# EAGLE design QFN triple breakout (EAGLE 6.1)
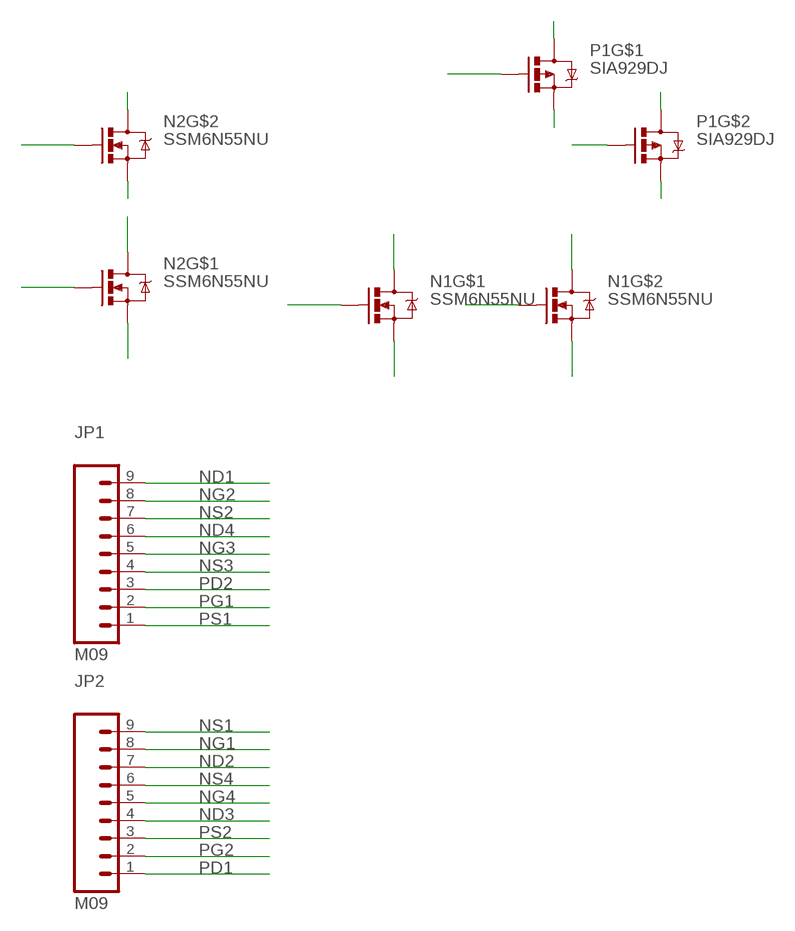
[diagram p0: schematic, sheet 1]

## Parts
JP1  M09  [1X09]
JP2  M09  [1X09]
N1  SSM6N55NU  [UDFN6]
N2  SSM6N55NU  [UDFN6]
P1  SIA929DJ  [SC70-6L]

## Nets
ND1: JP1.9 N2.D2$2(D) N2.D2(D)
ND2: JP2.7 N2.D1$1(D) N2.D1(D)
ND3: JP2.4 N1.D1$1(D) N1.D1(D)
ND4: JP1.6 N1.D2$2(D) N1.D2(D)
NG1: JP2.8 N2.G2(G)
NG2: JP1.8 N2.G1(G)
NG3: JP1.5 N1.G1(G)
NG4: JP2.5 N1.G2(G)
NS1: JP2.9 N2.S2(S)
NS2: JP1.7 N2.S1(S)
NS3: JP1.4 N1.S1(S)
NS4: JP2.6 N1.S2(S)
PD1: JP2.1 P1.D1$2(D) P1.D1(D)
PD2: JP1.3 P1.D2$2(D) P1.D2(D)
PG1: JP1.2 P1.G1(G)
PG2: JP2.2 P1.G2(G)
PS1: JP1.1 P1.S1(S)
PS2: JP2.3 P1.S2(S)

## Library data of the parts
JP1 JP2 = SparkFun-Connectors:M09: Header 9 Standard 9-pin 0.1" header. Use with straight break away headers (SKU : PRT-00116), right angle break away headers (PRT-00553), swiss pins (PRT-00743), machine pins (PRT-00117), and female headers (PRT-00115).
N1 N2 = Railstars:SSM6N55NU
P1 = Railstars:SIA929DJ

## Board
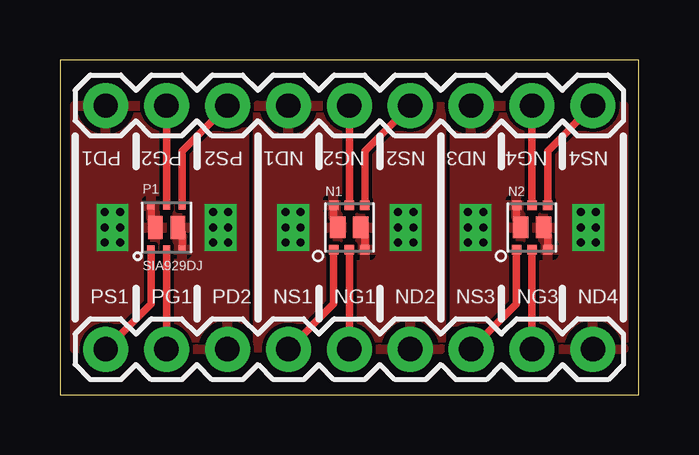
[diagram p1: board, top side]
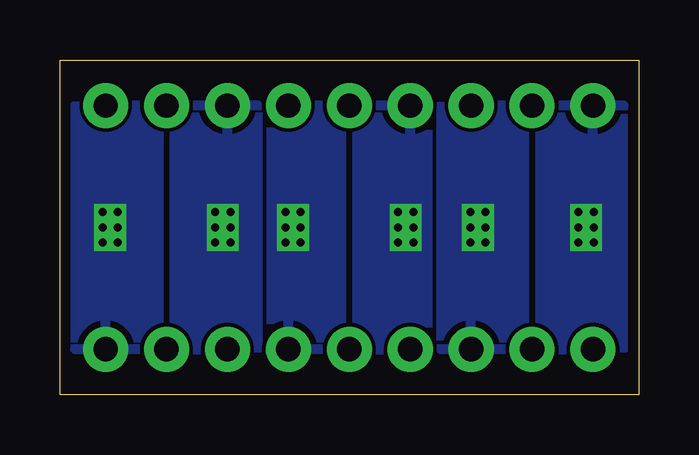
[diagram p2: board, bottom side, seen from below]

Size 24.13 x 13.97 mm. Coordinates in mm from the lower left corner, seen from the top.
Outline: 0,0 24.13,0 24.13,13.97 0,13.97 0,0
Copper layers (1*16): Top 0.0356mm / dielectric 1.5011mm / Bottom 0.0356mm
Design rules: minimum track width 6mil, minimum drill 13mil, track to track 6mil, track to pad 6mil, pad to pad 6mil, via to via 6mil, smd to smd 6mil, copper to edge 15mil, drill to drill 6mil, minimum pad ring 7mil, minimum via ring 7mil, stop-mask expansion 4mil, vias tented up to drill 0mil, thermal gap 10mil

### Footprints (pad centres in the part's own frame; a part is rotated, then mirrored left to right if it is on the bottom)
1X09 = drill 1.016 pad 1.88: 1 0,0; 2 2.54,0; 3 5.08,0; 4 7.62,0; 5 10.16,0; 6 12.7,0; 7 15.24,0; 8 17.78,0; 9 20.32,0
UDFN6 = smd 0.4 x 0.4: D1 -0.65,0.925; D2 0.65,-0.925; G1 0,-0.925; G2 0,0.925; S1 -0.65,-0.925; S2 0.65,0.925 | smd 0.65 x 0.9: D1$1 -0.475,0; D2$2 0.475,0
SC70-6L = smd 0.3 x 0.325: D1 -0.65,0.912; D2 0.65,-0.912; G1 0,-0.912; G2 0,0.912; S1 -0.65,-0.912; S2 0.65,0.912 | smd 0.613 x 0.95: D1$2 -0.467,0; D2$2 0.467,0

### Placement (x,y rotation side)
JP1  1.91,1.91 0 top
JP2  1.91,12.06 0 top
N1  12.06,6.99 0 top
N2  19.68,6.99 0 top
P1  4.45,6.99 0 top

### Tracks (layer width: path | path; a pad name or v marks a point on that pad's centre or on a via)
ND1  (via drill 0.33)
  Top 0.305: N2.D2 20.33,6.81 N2.D2$2
  other vias: 21.72,7.62 22.35,7.62 21.72,6.99 22.35,6.99 21.72,6.35 22.35,6.35
  pour Top: 19.68,12.06 23.49,12.06 23.49,1.91 19.68,1.91
  pour Bottom (rank 2): 20,12.06 23.49,12.06 23.49,1.91 20,1.91
ND2  (via drill 0.33)
  Top 0.305: N2.D1 19.04,7.16 N2.D1$1
  other vias: 17.02,7.62 17.65,7.62 17.02,6.99 17.65,6.99 17.02,6.35 17.65,6.35
  pour Top (rank 2): 15.88,12.06 19.68,12.06 19.68,1.91 15.88,1.91
  pour Bottom: 15.88,12.06 19.37,12.06 19.37,1.91 15.88,1.91
ND3  (via drill 0.33)
  Top 0.305: N1.D1 11.42,7.16 N1.D1$1
  other vias: 9.4,7.62 10.03,7.62 9.4,6.99 10.03,6.99 9.4,6.35 10.03,6.35
  pour Top: 8.26,12.06 11.75,12.06 11.75,1.91 8.26,1.91
  pour Bottom (rank 3): 8.26,12.06 11.75,12.06 11.75,1.91 8.26,1.91
ND4  (via drill 0.33)
  Top 0.305: N1.D2 12.71,6.81 N1.D2$2
  other vias: 14.1,7.62 14.73,7.62 14.1,6.35 14.1,6.99 14.73,6.99 14.73,6.35
  pour Bottom (rank 2): 12.38,12.06 15.88,12.06 15.88,1.91 12.38,1.91
  pour Top: 12.41,12.06 15.88,12.06 15.88,1.91 12.41,1.91
NG1
  Top 0.305: N2.G2 JP2.8
NG2
  Top 0.305: N2.G1 JP1.8
NG3
  Top 0.305: N1.G1 JP1.5
NG4
  Top 0.305: N1.G2 JP2.5
NS1
  Top 0.305: N2.S2 20.33,10.18 JP2.9
NS2
  Top 0.305: N2.S1 19.04,3.79 JP1.7
NS3
  Top 0.305: N1.S1 11.42,3.79 JP1.4
NS4
  Top 0.305: N1.S2 12.71,10.18 JP2.6
PD1  (via drill 0.33)
  Top 0.305: P1.D1 3.79,7.17 P1.D1$2
  other vias: 1.87,7.62 2.51,7.62 1.87,6.99 2.51,6.99 1.87,6.35 2.51,6.35
  pour Bottom: 0.64,12.06 4.13,12.06 4.13,1.91 0.64,1.91
  pour Top: 0.64,12.06 4.45,12.06 4.45,1.91 0.64,1.91
PD2  (via drill 0.33)
  Top 0.305: P1.D2 5.1,6.8 P1.D2$2
  other vias: 6.38,7.62 7.02,7.62 6.38,6.99 7.02,6.99 6.38,6.35 7.02,6.35
  pour Bottom (rank 2): 4.76,12.06 8.26,12.06 8.26,1.91 4.76,1.91
  pour Top (rank 2): 4.45,12.06 8.26,12.06 8.26,1.91 4.45,1.91
PG1
  Top 0.305: P1.G1 JP1.2
PG2
  Top 0.305: P1.G2 JP2.2
PS1
  Top 0.305: P1.S1 3.79,3.79 JP1.1
PS2
  Top 0.305: P1.S2 5.1,10.18 JP2.3

### Text on the board
tPlace: PD1 | PG2 | PS2 | ND1 | NG2 | NS2 | ND3 | NG4 | NS4 | PS1 | PG1 | PD2 | NS1 | NG1 | ND2 | NS3 | NG3 | ND4